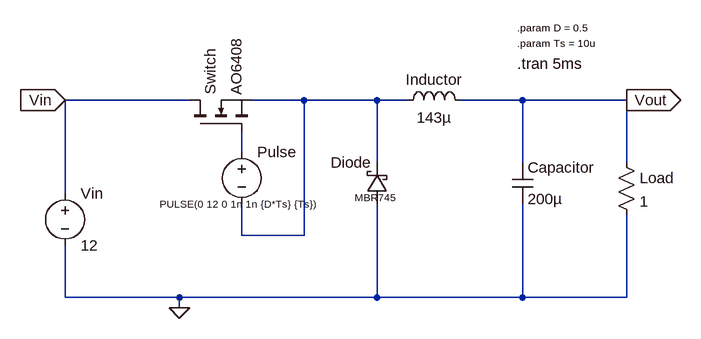
[diagram p0: schematic Shubham Rattra _ UE185112 _ exp5.asc]
Shubham Rattra _ UE185112 _ exp5.asc, the LTspice schematic file:
Version 4
SHEET 1 880 680
WIRE 64 32 -128 32
WIRE 240 32 160 32
WIRE 352 32 240 32
WIRE 400 32 352 32
WIRE 576 32 480 32
WIRE 736 32 576 32
WIRE 144 112 144 80
WIRE 352 128 352 32
WIRE 576 128 576 32
WIRE 736 128 736 32
WIRE -128 176 -128 32
WIRE 144 240 144 192
WIRE 240 240 240 32
WIRE 240 240 144 240
WIRE -128 336 -128 256
WIRE 48 336 -128 336
WIRE 352 336 352 192
WIRE 352 336 48 336
WIRE 576 336 576 192
WIRE 576 336 352 336
WIRE 736 336 736 208
WIRE 736 336 576 336
WIRE 48 352 48 336
FLAG 48 352 0
FLAG 736 32 Vout
IOPIN 736 32 Out
FLAG -128 32 Vin
IOPIN -128 32 In
SYMBOL voltage -128 160 R0
WINDOW 123 0 0 Left 0
WINDOW 39 0 0 Left 0
SYMATTR InstName Vin
SYMATTR Value 12
SYMBOL voltage 144 96 R0
WINDOW 3 -126 96 Left 1
WINDOW 123 0 0 Left 0
WINDOW 39 0 0 Left 0
SYMATTR InstName Pulse
SYMATTR Value PULSE(0 12 0 1n 1n {D*Ts} {Ts})
SYMBOL nmos 64 80 R270
SYMATTR InstName Switch
SYMATTR Value AO6408
SYMBOL ind 384 48 R270
WINDOW 0 32 56 VTop 2
WINDOW 3 5 56 VBottom 2
SYMATTR InstName Inductor
SYMATTR Value 143µ
SYMATTR SpiceLine Rser=20m
SYMBOL schottky 368 192 R180
WINDOW 0 24 64 Left 2
WINDOW 3 -12 10 Left 1
SYMATTR InstName Diode
SYMATTR Value MBR745
SYMATTR Description Diode
SYMATTR Type diode
SYMBOL cap 560 128 R0
SYMATTR InstName Capacitor
SYMATTR Value 200µ
SYMATTR SpiceLine Rser=1m
SYMBOL res 720 112 R0
SYMATTR InstName Load
SYMATTR Value 1
TEXT 568 -80 Left 1 !.param D = 0.5
TEXT 568 -56 Left 1 !.param Ts = 10u
TEXT 568 -24 Left 2 !.tran 5ms

The netlist it stands for:
* Shubham Rattra _ UE185112 _ exp5.asc
Vin Vin 0 12
V§Pulse N002 N001 PULSE(0 12 0 1n 1n {D*Ts} {Ts})
M§Switch Vin N002 N001 N001 AO6408
L§Inductor N001 Vout 143µ Rser=20m
Diode 0 N001 MBR745
Capacitor Vout 0 200µ Rser=1m
R§Load Vout 0 1
.model D D
.lib standard.dio
.model NMOS NMOS
.model PMOS PMOS
.lib standard.mos
.param D = 0.5
.param Ts = 10u
.tran 5ms
.backanno
.end